# Altium schematic sheet Sender_TransmiterPower.SchDoc
size A4
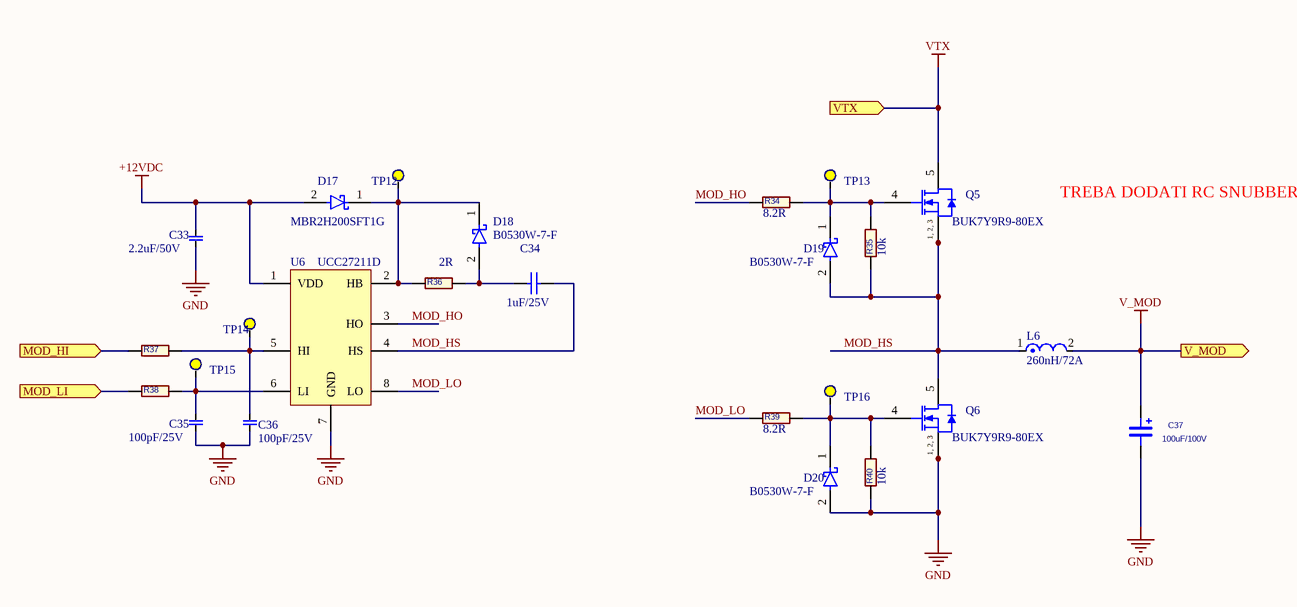
[diagram p0: Sender_TransmiterPower.SchDoc]

## Parts
C33  2.2uF/50V  [FP-CL31-IPC_B]
C34  1uF/25V  [CAPC2013X70X45LL10T25]
C35  100pF/25V  [C-0603]
C36  100pF/25V  [C-0603]
C37  100uF/100V  [CAP_16X25]
D17  MBR2H200SFT1G  [FP-498-MFG]
D18  B0530W-7-F  [FP-SOD123-IPC_B]
D19  B0530W-7-F  [FP-SOD123-IPC_B]
D20  B0530W-7-F  [FP-SOD123-IPC_B]
L6  260nH/72A  [PA2891_FOOTPRINT]
Q5  BUK7Y9R9-80EX  [NXP-SOT669_N]
Q6  BUK7Y9R9-80EX  [NXP-SOT669_N]
R34  8.2R  [RES-0805]
R35  10k  [R-0603]
R36  2R  [RESC3216X60X45NL10T20]
R37  1k  [R-0603]  (value not drawn)
R38  1k  [R-0603]  (value not drawn)
R39  8.2R  [RES-0805]
R40  10k  [R-0603]
TP12  Test_Point  [Test_Point]  (value not drawn)
TP13  Test_Point  [Test_Point]  (value not drawn)
TP14  Test_Point  [Test_Point]  (value not drawn)
TP15  Test_Point  [Test_Point]  (value not drawn)
TP16  Test_Point  [Test_Point]  (value not drawn)
U6  UCC27211D  [D-8 PIN 1.27pitch]

## Ports
MOD_HI (in), MOD_LI (in), V_MOD (out), VTX (in)

## Nets
+12VDC: C33.2(G) D17.2(A) U6.1(VDD)
GND: C33.1(G) C35.1(G) C36.1(G) C37.2 D20.2(A) Q6.1(S) Q6.2(S) Q6.3(S) R40.1 U6.7(GND)
V_MOD: C37.1 L6.2 ; port V_MOD
VTX: Q5.5(D) ; port VTX
MOD_HI: R37.1 ; port MOD_HI
MOD_HO: R34.1 U6.3(HO)
MOD_HS: C34.2 D19.2(A) L6.1 Q5.1(S) Q5.2(S) Q5.3(S) Q6.5(D) R35.1 U6.4(HS)
MOD_LI: R38.1 ; port MOD_LI
MOD_LO: R39.1 U6.8(LO)
NetC34_1: C34.1 D18.2(A) R36.2
NetC35_2: C35.2(G) R38.2 TP15.1 U6.6(LI)
NetC36_2: C36.2(G) R37.2 TP14.1 U6.5(HI)
NetD17_1: D17.1(C) D18.1(C) R36.1 TP12.1 U6.2(HB)
NetD19_1: D19.1(C) Q5.4(G) R34.2 R35.2 TP13.1
NetD20_1: D20.1(C) Q6.4(G) R39.2 R40.2 TP16.1

## Notes on the sheet
- TREBA DODATI RC SNUBBER
- (in symbol BUK7Y9R9-80EX) 1, 2, 3

## Library data of the parts
C33 = CL31B225KBHVPNE: Cap Ceramic 2.2uF 50V X7R ±10% SMD 1206 +125°C Embossed T/R; Width: 0.063inch; Case/Package: 1206; Tolerance: 10%; Mount: Surface Mount; Capacitance: 2.2uF; Ratings: AEC-Q200; Thickness: 0.071inch; Voltage Rating: 50V; Features: Soft Termination; Case Code (Metric): 3216; Length: 0.126inch; Packaging: Tape and Reel; Max Operating Temperature: 125°C; Min Operating Temperature: -55°C; Case Code (Imperial): 1206; Dielectric: X7R
C34 = GRM216R61E105KA12D: 1µF ±10% 25V Ceramic Capacitor X5R 0805 (2012 Metric); Manufacturer: Murata; Part Number: GRM216R61E105KA12D
C35 C36 = C0201C101J3GACTU: 100pF ±5% 25V Ceramic Capacitor C0G, NP0 0201 (0603 Metric); Manufacturer: KEMET; Capacitance: 100pF; Case Code (Imperial): 0201; Case Code (Metric): 0603; Case/Package: 0201; Category: Ceramic Capacitors; Construction: Flat; Depth: 0.3mm; Dielectric: C0G; Height: 0.3mm; Length: 0.6mm; Manufacturer Part Number: C0201C101J3GACTU; Max Operating Temperature: 125°C; Min Operating Temperature: -55°C; Mount: Surface Mount; Package Quantity: 1; Packaging: Tape and Reel; Radiation Hardening: No; RoHS Compliant: Yes; Series: C; Thickness: 0.013inch; Tolerance: 5%; Voltage: 25V; Voltage Rating: 25V; Width: 0.3mm; ComponentLink1URL: https://datasheet.ciiva.com/25795/cl31b106kahnnne-25795260.pdf?src-supplier=Digi-Key; ComponentLink1Description: https://datasheet.ciiva.com/25795/cl31b106kahnnne-25795260.pdf?src-supplier=Digi-Key; Contact Plating: Tin,Matte; REACH SVHC: No SVHC; Termination: SMD/SMT; Voltage Rating (DC): 25V; Weight: 6E-06oz
C37 = CAP_470uF_100V: Capacitor
D17 = MBR2H200SFT1G: DIODE SCHOTTKY 200V 2A SOD123FL; Manufacturer: ON Semiconductor; Peak Reverse Current: 200uA; Max Surge Forward Current: 30A; Max Junction Temp: +150°C; Standoff Height: 0mm; Device Class L1: Discrete Semiconductors; Package: 498; Temperature Range High: +150°C; Height: 0.98mm; Temperature: -55°C to +150°C; Forward Current: 2A; Octopart: https://octopart.com/mbr2h200sft1g-on+semiconductor-51167333; Reverse Voltage: 200V; Max Repetitive Reverse Voltage: 200V; RoHS: TRUE; Lead Free: Yes; Footprint Url: https://www.onsemi.com/pub/Collateral/498-01.PDF; ComponentLink2Description: Datasheet; Category: Diode; Manufacturer Part Number: MBR2H200SFT1G; Digikey Description: DIODE SCHOTTKY 200V 2A SOD123FL; Device Class L3: Schottky Diodes; Temperature Range Low: -55°C; ComponentLink2URL: https://www.onsemi.com/pub/Collateral/MBR2H200SF-D.PDF; Automotive: No; Device Class L2: Diodes
D18-D20 = B0530W-7-F: DIODE SCHOTTKY 30V 500MA SOD123; Manufacturer: Diodes Inc.; Max Surge Forward Current: 5.5A; Forward Current: 0.5A; Max Junction Temp: +125°C; Standoff Height: 0mm; Capacitance: 170pF; Value: 170pF; Peak Reverse Current: 130uA; Footprint Url: https://www.diodes.com/assets/Package-Files/SOD123.pdf; Device Class L1: Discrete Semiconductors; ComponentLink2Description: Datasheet; Mouser Description: Schottky Diodes & Rectifiers 30V 410mW; Device Class L3: Schottky Diodes; Package: SOD123; Temperature: -65°C to +125°C; Temperature Range Low: -65°C; Lead Free: Yes; Digikey Description: DIODE SCHOTTKY 30V 500MA SOD123; Ipc Land Pattern Name: SOD365155X123-2; Automotive: No; Octopart: https://octopart.com/b0530w-7-f-diodes+inc.-325721; Device Class L2: Diodes; ComponentLink2URL: https://www.diodes.com/assets/Datasheets/ds30139.pdf; RoHS: TRUE; Height: 1.45mm; Max Repetitive Reverse Voltage: 30V; Category: Diode; Temperature Range High: +125°C; Manufacturer Part Number: B0530W-7-F; Reverse Voltage: 30V
L6 = PA2891.261HL: 260nH Shielded  Inductor 72A 0.22mOhm Nonstandard; Manufacturer: Pulse; Manufacturer Part Number: PA2891.261HLT; Shielding: Unshielded; Tolerance: 10%; Saturation Current: 67A; DC Resistance (DCR): 0.22mR; Core Material: Ferrite; Test Frequency: 100kHz; Current Rating: 72A; Height - Seated (Max): 0.19inch; Mount: Surface Mount; Resistor Type: Wirewound; Inductance: 260nH; Packaging: Bulk; Min Operating Temperature: -40°C; Length: 0.539inch; Width: 0.51inch; Case/Package: SMD/SMT; Max Operating Temperature: 85°C; Category: Fixed Inductors; Package Quantity: 1; RoHS Compliant: Yes; Series: PA2891.XXXHL
Q5 Q6 = BUK7Y9R9-80EX: N-Channel 80V 89A (Tc) 195W (Tc) Surface Mount LFPAK56, Power-SO8; Manufacturer: Nexperia; Category: MOSFETs; Manufacturer Part Number: BUK7Y9R9-80EX; RoHS Compliant: No; ComponentLink1URL: https://assets.nexperia.com/documents/data-sheet/BUK7Y9R9-80E.pdf?src-supplier=Digi-Key; ComponentLink1Description: https://assets.nexperia.com/documents/data-sheet/BUK7Y9R9-80E.pdf?src-supplier=Digi-Key
R34 R39 = CRCW08058R20JNEA: 8.2 Ohms ±5% 0.125W, 1/8W Chip Resistor 0805 (2012 Metric) Automotive AEC-Q200 Thick Film; Manufacturer: Vishay Dale; Max Power Dissipation: 125mW; Temperature Coefficient: 200ppm/°C; Voltage Rating: 150V; Case Code (Imperial): 0805; Case Code (Metric): 2012; Case/Package: 0805; Category: Chip SMD Resistors; Construction: Rectangular; Contact Plating: Tin; Depth: 1.25mm; Features: Automotive AEC-Q200; Height: 0.02inch; Lead Free: Lead Free; Length: 2mm; Manufacturer Part Number: CRCW08058R20JNEA; Max Operating Temperature: 155°C; Military Standard: Not; Min Operating Temperature: -55°C; Mount: Surface Mount; Number of Pins: 2; Number of Terminations: 2; Package Quantity: 1; Packaging: Tape and Reel; Power Rating: 125mW; Radiation Hardening: No; REACH SVHC: Unknown; Resistance: 8.2R; Resistance Tolerance: 5%; Resistor Type: Thick Film; RoHS Compliant: Yes; Series: CRCW; Size Code: 0805; Tolerance: 5%; Voltage Rating (DC): 150V; Weight: 0.000194oz; Width: 1.25mm; ComponentLink1URL: https://datasheet.ciiva.com/2512/dcrcwe3-2512297.pdf?src-supplier=Digi-Key; ComponentLink1Description: https://datasheet.ciiva.com/2512/dcrcwe3-2512297.pdf?src-supplier=Digi-Key
R35 R40 = RR0816P-103-D: 10 kOhms ±0.5% 0.063W, 1/16W Chip Resistor 0603 (1608 Metric)  Thin Film; Manufacturer: Susumu; Max Power Dissipation: 63mW; Resistance: 10kR; Temperature Coefficient: 25ppm/°C; Voltage Rating: 75V; Width: 0.8mm; Case Code (Imperial): 0603; Case Code (Metric): 1608; Case/Package: 0603; Category: Chip SMD Resistors; Depth: 0.8mm; Height: 0.4mm; Lead Free: Lead Free; Length: 1.6mm; Manufacturer Part Number: RR0816P-103-D; Max Operating Temperature: 125°C; Min Operating Temperature: -55°C; Number of Pins: 2; Number of Terminations: 2; Package Quantity: 1; Packaging: Tape and Reel; Power Rating: 63mW; REACH SVHC: Unknown; Resistance Tolerance: 0.5%; Resistor Type: Thin Film; RoHS Compliant: Yes; Series: RR; Size Code: 0603; Technology: THIN FILM; Termination: SMD/SMT; Tolerance: 0.5%; Voltage Rating (DC): 75V; Weight: 7.1E-05oz
R36 = CRCW12062R00FKEA: 2 Ohms ±1% 0.25W, 1/4W Chip Resistor 1206 (3216 Metric) Automotive AEC-Q200 Thick Film; Manufacturer: Vishay Dale; Max Power Dissipation: 250mW; Temperature Coefficient: 100ppm/°C; Voltage Rating: 200V; Case Code (Imperial): 1206; Case Code (Metric): 3216; Case/Package: 1206; Category: Chip SMD Resistors; Construction: Rectangular; Contact Plating: Tin; Depth: 1.6mm; Features: Automotive AEC-Q200; Height: 0.024inch; Lead Free: Lead Free; Length: 3.2mm; Manufacturer Part Number: CRCW12062R00FKEA; Max Operating Temperature: 155°C; Military Standard: Not; Min Operating Temperature: -55°C; Number of Pins: 2; Number of Terminations: 2; Package Quantity: 10; Packaging: Tape and Reel; Power Rating: 250mW; Radiation Hardening: No; REACH SVHC: Unknown; Resistance: 2R; Resistance Tolerance: 1%; Resistor Type: Thick Film; RoHS Compliant: Yes; Series: CRCW; Termination: SMD/SMT; Tolerance: 1%; Voltage Rating (DC): 200V; Weight: 0.000353oz; Width: 1.6mm; ComponentLink1URL: https://datasheet.ciiva.com/2469/dcrcwe3-2469237.pdf?src-supplier=Digi-Key; ComponentLink1Description: https://datasheet.ciiva.com/2469/dcrcwe3-2469237.pdf?src-supplier=Digi-Key
R37 R38 = RR0816P-102-D: 1 kOhms ±0.5% 0.063W, 1/16W Chip Resistor 0603 (1608 Metric)  Thin Film; Manufacturer: Susumu; Max Power Dissipation: 63mW; Resistance: 1kR; Temperature Coefficient: 25ppm/°C; Voltage Rating: 75V; Width: 0.031inch; Case Code (Imperial): 0603; Case Code (Metric): 1608; Case/Package: 0603; Category: Chip SMD Resistors; Depth: 0.8mm; Height: 0.4mm; Lead Free: Lead Free; Length: 1.6mm; Manufacturer Part Number: RR0816P-102-D; Max Operating Temperature: 125°C; Min Operating Temperature: -55°C; Number of Pins: 2; Number of Terminations: 2; Package Quantity: 1; Packaging: Tape and Reel; Power Rating: 63mW; REACH SVHC: Unknown; Resistance Tolerance: 0.5%; Resistor Type: Thin Film; RoHS Compliant: Yes; Series: RR; Size Code: 0603; Technology: THIN FILM; Termination: SMD/SMT; Tolerance: 0.5%; Voltage Rating (DC): 75V; ComponentLink1URL: https://datasheet.ciiva.com/2487/rr-data-sheet-2487025.pdf?src-supplier=Digi-Key; ComponentLink1Description: https://datasheet.ciiva.com/2487/rr-data-sheet-2487025.pdf?src-supplier=Digi-Key
U6 = UCC27211D: Half-Bridge Gate Driver IC Non-Inverting 8-SOIC; Manufacturer: Texas Instruments; Fall Time: 400ns; Max Output Current: 4A; Max Supply Current: 4.3mA; Max Supply Voltage: 17V; Min Supply Voltage: 8V; Number of Channels: 2; Operating Supply Voltage: 12V; Propagation Delay: 40ns; Rise Time: 600ns; Case/Package: SOIC; Category: Gate Drivers; Height: 1.5mm; Lead Free: Lead Free; Length: 5mm; Manufacturer Part Number: UCC27211D; Max Operating Temperature: 140°C; Min Operating Temperature: -40°C; Mount: Surface Mount; Nominal Supply Current: 4A; Number of Drivers: 2; Number of Outputs: 2; Number of Pins: 8; Output Current: 4A; Package Quantity: 75; Packaging: Rail/Tube; Radiation Hardening: No; REACH SVHC: No SVHC; RoHS Compliant: Yes; Series: -; Supply Current: 4A; Turn-On Delay Time: 40ns; Width: 4mm; ComponentLink1URL: https://datasheet.ciiva.com/1951/ucc27210-1951181.pdf?src-supplier=Digi-Key; ComponentLink1Description: https://datasheet.ciiva.com/1951/ucc27210-1951181.pdf?src-supplier=Digi-Key